# EAGLE design NN22_IMU_Adapter01_s00 (EAGLE 7.7.0)

## Sheet 1 of 2
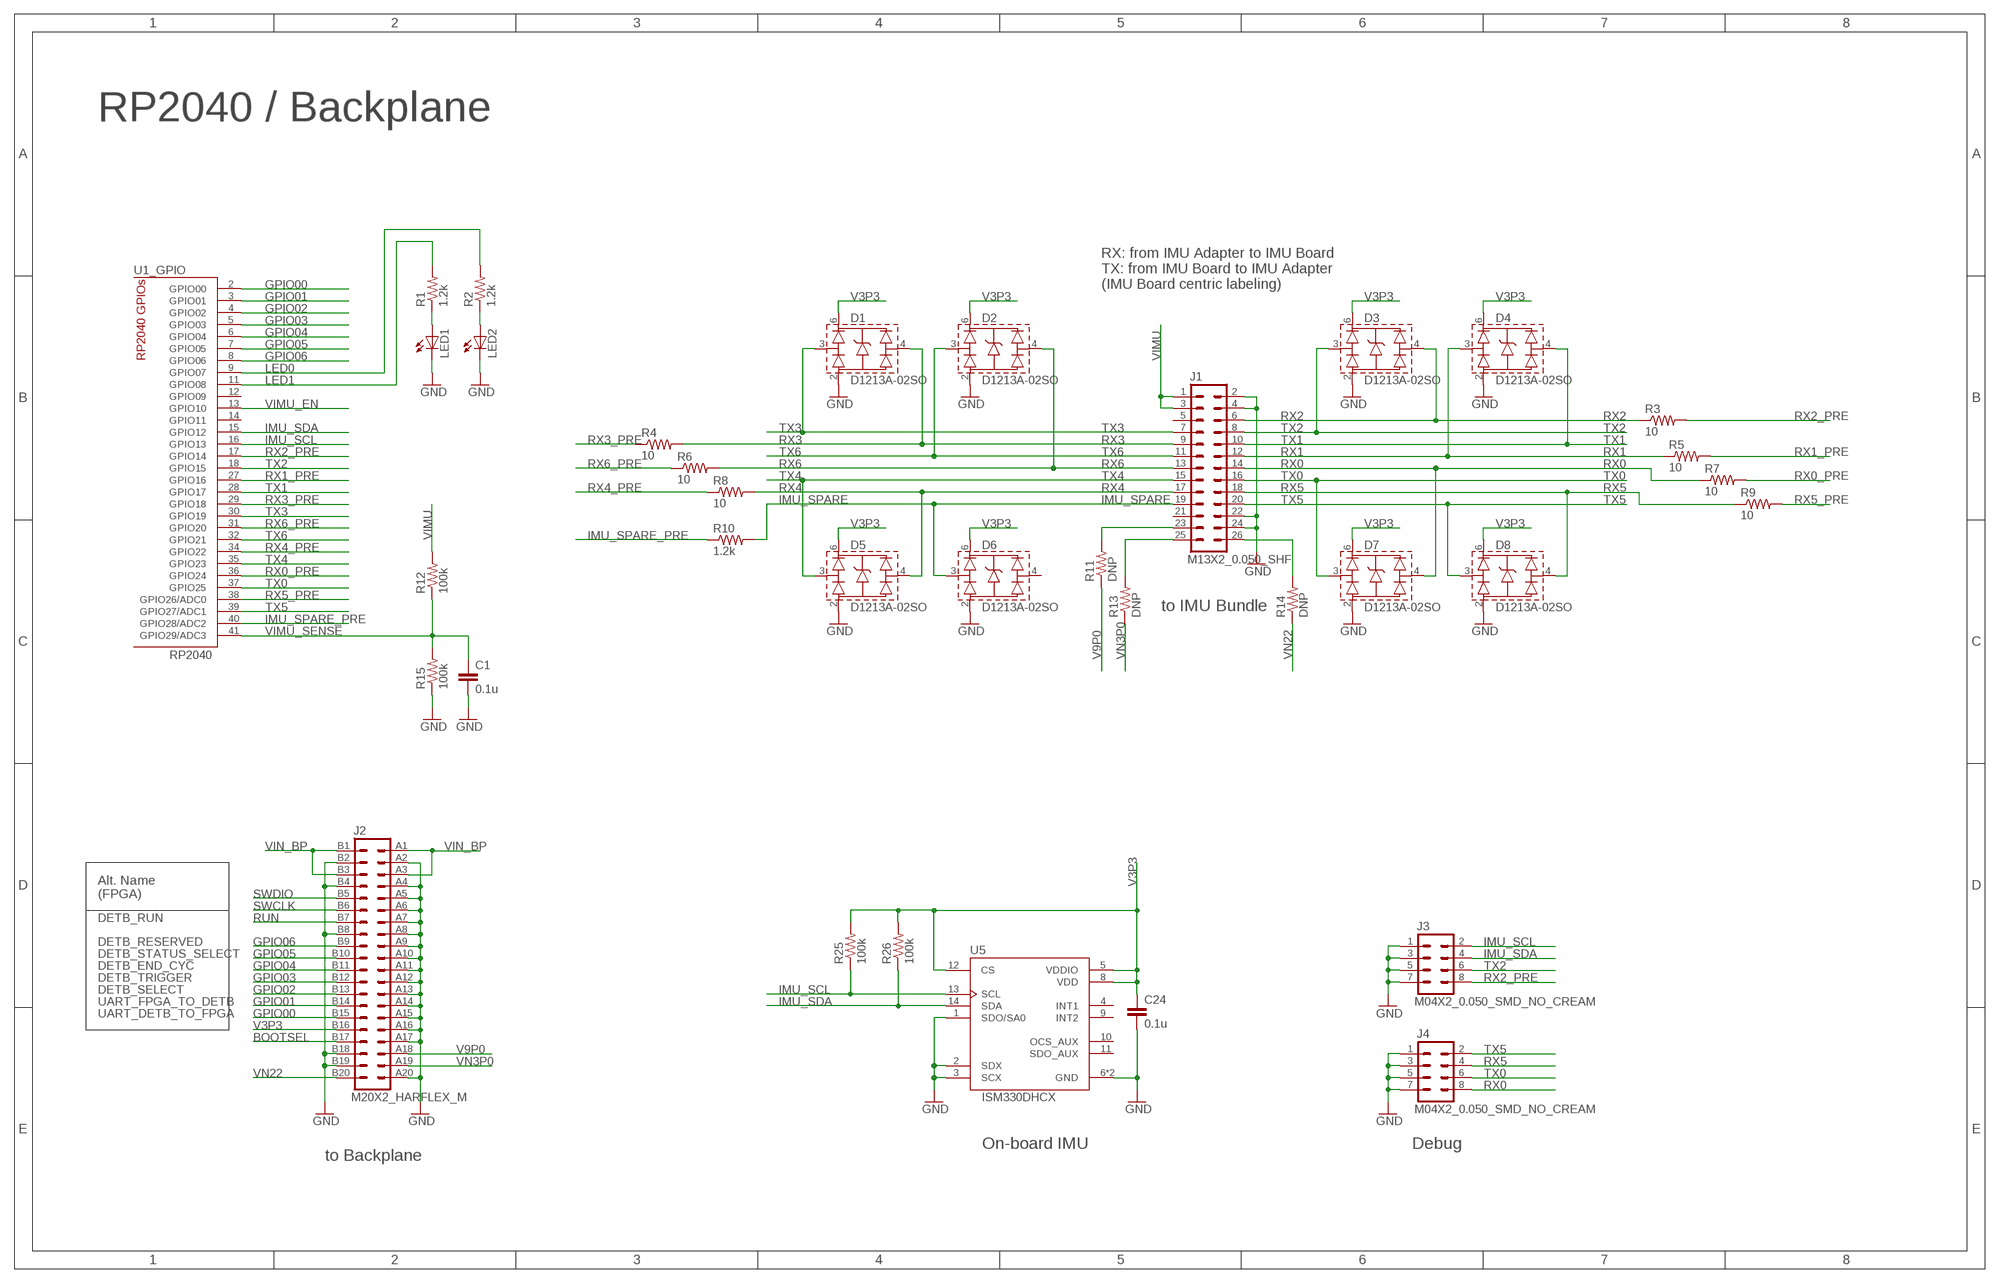
[diagram p0: schematic, sheet 1]

### Parts
C1  0.1u  CAP0402-CAP  [0402-CAP]
C24  0.1u  CAP0402-CAP  [0402-CAP]
D1  D1213A-02SO  [SOT23-6]
D2  D1213A-02SO  [SOT23-6]
D3  D1213A-02SO  [SOT23-6]
D4  D1213A-02SO  [SOT23-6]
D5  D1213A-02SO  [SOT23-6]
D6  D1213A-02SO  [SOT23-6]
D7  D1213A-02SO  [SOT23-6]
D8  D1213A-02SO  [SOT23-6]
J1  M13X2_0.050_SHF  [M13X2_0.050_SHF]
J2  M20X2_HARFLEX_M  [M20X2_HARFLEX_M]
J3  M04X2_0.050_SMD_NO_CREAM  [M04X2_0.050_SMD_NO_CREAM]
J4  M04X2_0.050_SMD_NO_CREAM  [M04X2_0.050_SMD_NO_CREAM]
LED1  LED0603  [LED-0603]
LED2  LED0603  [LED-0603]
R1  1.2k  RESISTOR0402-RES  [0402-RES]
R2  1.2k  RESISTOR0402-RES  [0402-RES]
R3  10  RESISTOR0402-RES  [0402-RES]
R4  10  RESISTOR0402-RES  [0402-RES]
R5  10  RESISTOR0402-RES  [0402-RES]
R6  10  RESISTOR0402-RES  [0402-RES]
R7  10  RESISTOR0402-RES  [0402-RES]
R8  10  RESISTOR0402-RES  [0402-RES]
R9  10  RESISTOR0402-RES  [0402-RES]
R10  1.2k  RESISTOR0402-RES  [0402-RES]
R11  DNP  RESISTOR0603-RES  [0603-RES]
R12  100k  RESISTOR0402-RES  [0402-RES]
R13  DNP  RESISTOR0603-RES  [0603-RES]
R14  DNP  RESISTOR0603-RES  [0603-RES]
R15  100k  RESISTOR0402-RES  [0402-RES]
R25  100k  RESISTOR0402-RES  [0402-RES]
R26  100k  RESISTOR0402-RES  [0402-RES]
U1  RP2040  [QFN-56_EP]
U5  ISM330DHCX  [LGA14-L]

### Nets
BOOTSEL: J2.B17 ; also sheet 2
GND: C1.2 C24.2 D1.2(VN) D2.2(VN) D3.2(VN) D4.2(VN) D5.2(VN) D6.2(VN) D7.2(VN) D8.2(VN) J1.2 J1.4 J1.22 J1.24 J2.A2 J2.A4 J2.A5 J2.A6 J2.A7 J2.A8 J2.A9 J2.A10 J2.A11 J2.A12 J2.A13 J2.A14 J2.A15 J2.A16 J2.A17 J2.A20 J2.B2 J2.B4 J2.B8 J2.B18 J2.B19 J3.1 J3.3 J3.5 J3.7 J4.1 J4.3 J4.5 J4.7 LED1.C LED2.C R15.1 U5.1(SDO/SA0) U5.2(SDX) U5.3(SCX) U5.6(GND) U5.7(GND) ; also sheet 2
GPIO00: J2.B15 U1.2(_GPIO:GPIO00)
GPIO01: J2.B14 U1.3(_GPIO:GPIO01)
GPIO02: J2.B13 U1.4(_GPIO:GPIO02)
GPIO03: J2.B12 U1.5(_GPIO:GPIO03)
GPIO04: J2.B11 U1.6(_GPIO:GPIO04)
GPIO05: J2.B10 U1.7(_GPIO:GPIO05)
GPIO06: J2.B9 U1.8(_GPIO:GPIO06)
IMU_SCL: J3.2 R25.1 U1.16(_GPIO:GPIO13) U5.13(SCL)
IMU_SDA: J3.4 R26.1 U1.15(_GPIO:GPIO12) U5.14(SDA)
IMU_SPARE: D6.3(CH1) J1.19 R10.2
IMU_SPARE_PRE: R10.1 U1.40(_GPIO:GPIO28/ADC2)
LED0: R2.2 U1.9(_GPIO:GPIO07)
LED1: R1.2 U1.11(_GPIO:GPIO08)
N$6: J1.23 R11.2
N$7: J1.25 R13.2
N$8: J1.26 R14.2
N$46: LED1.A R1.1
N$109: LED2.A R2.1
RUN: J2.B7 ; also sheet 2
RX0: D7.4(CH2) J1.14 J4.8 R7.1
RX0_PRE: R7.2 U1.36(_GPIO:GPIO24)
RX1: D4.3(CH1) J1.12 R5.1
RX1_PRE: R5.2 U1.27(_GPIO:GPIO16)
RX2: D3.4(CH2) J1.6 R3.1
RX2_PRE: J3.8 R3.2 U1.17(_GPIO:GPIO14)
RX3: D1.4(CH2) J1.9 R4.2
RX3_PRE: R4.1 U1.29(_GPIO:GPIO18)
RX4: D5.4(CH2) J1.17 R8.2
RX4_PRE: R8.1 U1.34(_GPIO:GPIO22)
RX5: D8.4(CH2) J1.18 J4.4 R9.1
RX5_PRE: R9.2 U1.38(_GPIO:GPIO26/ADC0)
RX6: D2.4(CH2) J1.13 R6.2
RX6_PRE: R6.1 U1.31(_GPIO:GPIO20)
SWCLK: J2.B6 ; also sheet 2
SWDIO: J2.B5 ; also sheet 2
TX0: D7.3(CH1) J1.16 J4.6 U1.37(_GPIO:GPIO25)
TX1: D4.4(CH2) J1.10 U1.28(_GPIO:GPIO17)
TX2: D3.3(CH1) J1.8 J3.6 U1.18(_GPIO:GPIO15)
TX3: D1.3(CH1) J1.7 U1.30(_GPIO:GPIO19)
TX4: D5.3(CH1) J1.15 U1.35(_GPIO:GPIO23)
TX5: D8.3(CH1) J1.20 J4.2 U1.39(_GPIO:GPIO27/ADC1)
TX6: D2.3(CH1) J1.11 U1.32(_GPIO:GPIO21)
V3P3: C24.1 D1.6(VP) D2.6(VP) D3.6(VP) D4.6(VP) D5.6(VP) D6.6(VP) D7.6(VP) D8.6(VP) J2.B16 R25.2 R26.2 U5.5(VDDIO) U5.8(VDD) U5.12(CS) ; also sheet 2
V9P0: J2.A18 R11.1
VIMU: J1.1 J1.3 R12.2 ; also sheet 2
VIMU_EN: U1.13(_GPIO:GPIO10) ; also sheet 2
VIMU_SENSE: C1.1 R12.1 R15.2 U1.41(_GPIO:GPIO29/ADC3)
VIN_BP: J2.A1 J2.A3 J2.B1 J2.B3 ; also sheet 2
VN3P0: J2.A19 R13.1
VN22: J2.B20 R14.1
Unconnected: D6.4(CH2) J1.5 J1.21 U1.12(_GPIO:GPIO09) U1.14(_GPIO:GPIO11) U5.4(INT1) U5.9(INT2) U5.10(OCS_AUX) U5.11(SDO_AUX)

### Notes on the sheet
- RP2040 / Backplane
- RX: from IMU Adapter to IMU Board
  TX: from IMU Board to IMU Adapter
  (IMU Board centric labeling)
- to IMU Bundle
- Alt. Name
  (FPGA)
- DETB_RUN
- DETB_RESERVED
- DETB_STATUS_SELECT
- DETB_END_CYC
- DETB_TRIGGER
- DETB_SELECT
- UART_FPGA_TO_DETB
- UART_DETB_TO_FPGA
- On-board IMU | Debug
- to Backplane

## Sheet 2 of 2
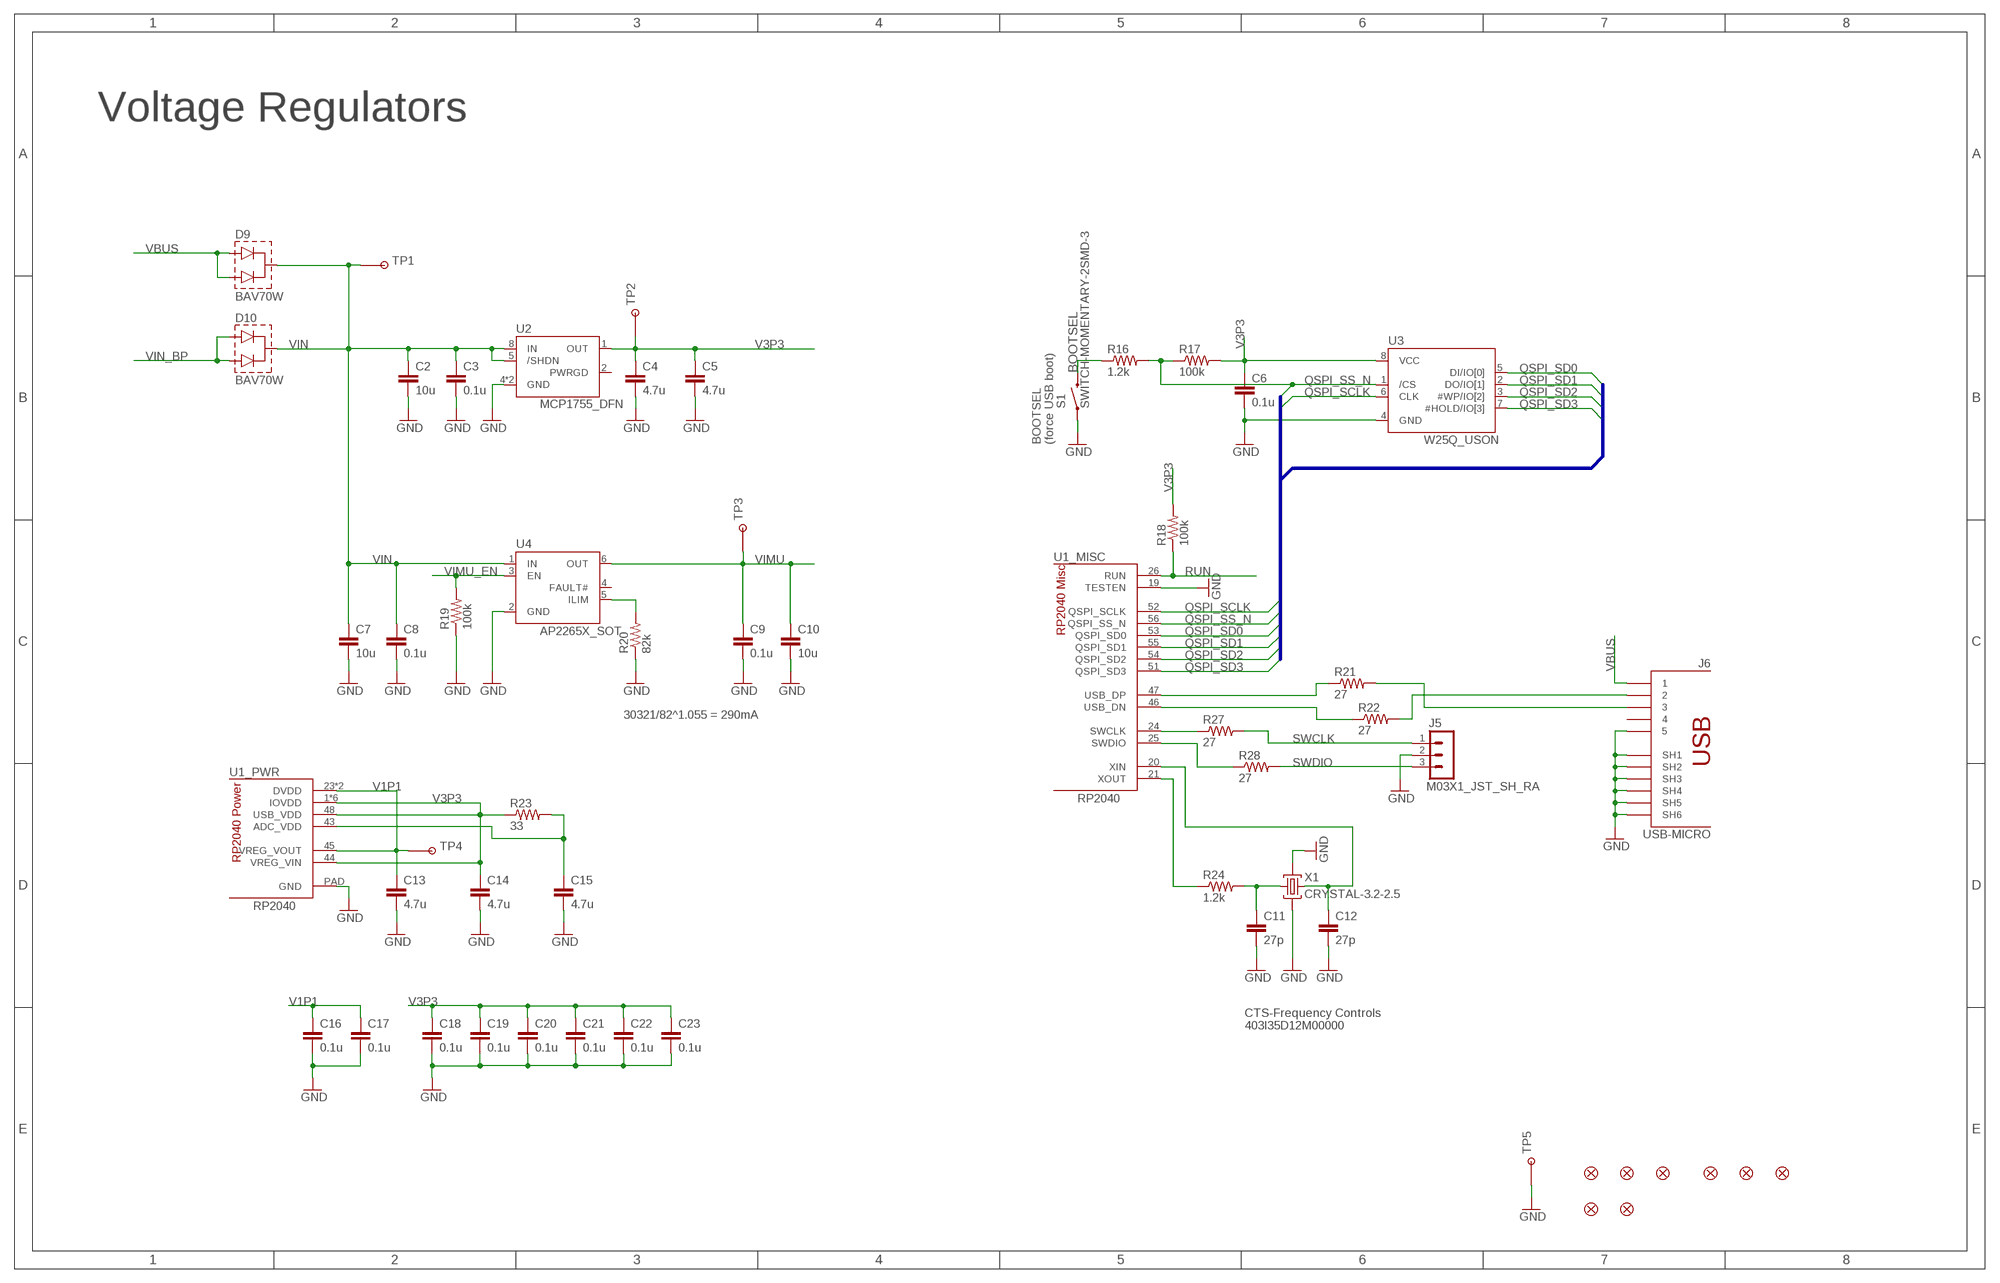
[diagram p1: schematic, sheet 2]

### Parts
C2  10u  CAP0603-CAP  [0603-CAP]
C3  0.1u  CAP0402-CAP  [0402-CAP]
C4  4.7u  CAP0402-CAP  [0402-CAP]
C5  4.7u  CAP0402-CAP  [0402-CAP]
C6  0.1u  CAP0402-CAP  [0402-CAP]
C7  10u  CAP0603-CAP  [0603-CAP]
C8  0.1u  CAP0402-CAP  [0402-CAP]
C9  0.1u  CAP0402-CAP  [0402-CAP]
C10  10u  CAP0603-CAP  [0603-CAP]
C11  27p  CAP0402-CAP  [0402-CAP]
C12  27p  CAP0402-CAP  [0402-CAP]
C13  4.7u  CAP0402-CAP  [0402-CAP]
C14  4.7u  CAP0402-CAP  [0402-CAP]
C15  4.7u  CAP0402-CAP  [0402-CAP]
C16  0.1u  CAP0402-CAP  [0402-CAP]
C17  0.1u  CAP0402-CAP  [0402-CAP]
C18  0.1u  CAP0402-CAP  [0402-CAP]
C19  0.1u  CAP0402-CAP  [0402-CAP]
C20  0.1u  CAP0402-CAP  [0402-CAP]
C21  0.1u  CAP0402-CAP  [0402-CAP]
C22  0.1u  CAP0402-CAP  [0402-CAP]
C23  0.1u  CAP0402-CAP  [0402-CAP]
D9  BAV70W  DIODE-COMMON_CATHODE_SOT323  [SOT323]
D10  BAV70W  DIODE-COMMON_CATHODE_SOT323  [SOT323]
FID1  FIDUCIALUFIDUCIAL  [MICRO-FIDUCIAL]
FID2  FIDUCIALUFIDUCIAL  [MICRO-FIDUCIAL]
FID3  FIDUCIALUFIDUCIAL  [MICRO-FIDUCIAL]
FID4  FIDUCIALUFIDUCIAL  [MICRO-FIDUCIAL]
FID5  FIDUCIALUFIDUCIAL  [MICRO-FIDUCIAL]
FID6  FIDUCIALUFIDUCIAL  [MICRO-FIDUCIAL]
FID7  FIDUCIALUFIDUCIAL  [MICRO-FIDUCIAL]
FID8  FIDUCIALUFIDUCIAL  [MICRO-FIDUCIAL]
J5  M03X1_JST_SH_RA  [M03X1_JST_SH_SM_RA]
J6  USB-MICRO  [USB-MICRO]
R16  1.2k  RESISTOR0402-RES  [0402-RES]
R17  100k  RESISTOR0402-RES  [0402-RES]
R18  100k  RESISTOR0402-RES  [0402-RES]
R19  100k  RESISTOR0402-RES  [0402-RES]
R20  82k  RESISTOR0402-RES  [0402-RES]
R21  27  RESISTOR0402-RES  [0402-RES]
R22  27  RESISTOR0402-RES  [0402-RES]
R23  33  RESISTOR0402-RES  [0402-RES]
R24  1.2k  RESISTOR0402-RES  [0402-RES]
R27  27  RESISTOR0402-RES  [0402-RES]
R28  27  RESISTOR0402-RES  [0402-RES]
S1  SWITCH-MOMENTARY-2SMD-3  [TACTILE_SWITCH_SMD-3]
TP1  TESTPOINT_ROUND  [TESTPAD_ROUND]
TP2  TESTPOINT_ROUND  [TESTPAD_ROUND]
TP3  TESTPOINT_ROUND  [TESTPAD_ROUND]
TP4  TESTPOINTPADSMALL  [TESTPAD_SMALL]
TP5  TESTPOINT1X01  [1X01]
U2  MCP1755_DFN  [DFN8_2X3MM]
U3  W25Q_USON  [USON8L-2X3MM]
U4  AP2265X_SOT  [SOT23-6]
X1  CRYSTAL-3.2-2.5  [CRYSTAL-3.2-2.5]

### Nets
BOOTSEL: R16.1 S1.4 ; also sheet 1
GND: C2.2 C3.2 C4.2 C5.2 C6.2 C7.2 C8.2 C9.2 C10.2 C11.2 C12.2 C13.2 C14.2 C15.2 C16.2 C17.2 C18.2 C19.2 C20.2 C21.2 C22.2 C23.2 J5.2 J6.5 J6.SH1 J6.SH2 J6.SH3 J6.SH4 J6.SH5 J6.SH6 R19.1 R20.1 S1.1 TP5.1 U1.19(_MISC:TESTEN) U1.PAD(_PWR:GND) U2.4(GND) U2.P(GND) U3.4(GND) U4.2(GND) X1.2(GND) X1.4(GND) ; also sheet 1
N$1: R20.2 U4.5(ILIM)
N$16: C12.1 U1.20(_MISC:XIN) X1.3(C2)
N$17: C11.1 R24.2 X1.1(C1)
N$18: R24.1 U1.21(_MISC:XOUT)
N$29: R21.1 U1.47(_MISC:USB_DP)
N$30: R22.1 U1.46(_MISC:USB_DN)
N$35: J6.2 R22.2
N$37: J6.3 R21.2
N$43: C15.1 R23.2 U1.43(_PWR:ADC_VDD)
QSPI_SCLK: U1.52(_MISC:QSPI_SCLK) U3.6(CLK)
QSPI_SD0: U1.53(_MISC:QSPI_SD0) U3.5(DI/IO[0])
QSPI_SD1: U1.55(_MISC:QSPI_SD1) U3.2(DO/IO[1])
QSPI_SD2: U1.54(_MISC:QSPI_SD2) U3.3(#WP/IO[2])
QSPI_SD3: U1.51(_MISC:QSPI_SD3) U3.7(#HOLD/IO[3])
QSPI_SS_N: R16.2 R17.1 U1.56(_MISC:QSPI_SS_N) U3.1(/CS)
RUN: R18.1 U1.26(_MISC:RUN) ; also sheet 1
SWCLK: J5.1 R27.2 ; also sheet 1
SWCLK_PRE: R27.1 U1.24(_MISC:SWCLK)
SWDIO: J5.3 R28.2 ; also sheet 1
SWDIO_PRE: R28.1 U1.25(_MISC:SWDIO)
V1P1: C13.1 C16.1 C17.1 TP4.P$1 U1.23(_PWR:DVDD) U1.45(_PWR:VREG_VOUT) U1.50(_PWR:DVDD)
V3P3: C4.1 C5.1 C6.1 C14.1 C18.1 C19.1 C20.1 C21.1 C22.1 C23.1 R17.2 R18.2 R23.1 TP2.P$1 U1.1(_PWR:IOVDD) U1.10(_PWR:IOVDD) U1.22(_PWR:IOVDD) U1.33(_PWR:IOVDD) U1.42(_PWR:IOVDD) U1.44(_PWR:VREG_VIN) U1.48(_PWR:USB_VDD) U1.49(_PWR:IOVDD) U2.1(OUT) U3.8(VCC) ; also sheet 1
VBUS: D9.1(A1) D9.2(A2) J6.1
VIMU: C9.1 C10.1 TP3.P$1 U4.6(OUT) ; also sheet 1
VIMU_EN: R19.2 U4.3(EN) ; also sheet 1
VIN: C2.1 C3.1 C7.1 C8.1 D9.3(C) D10.3(C) TP1.P$1 U2.5(/SHDN) U2.8(IN) U4.1(IN)
VIN_BP: D10.1(A1) D10.2(A2) ; also sheet 1
Unconnected: J6.4 U2.2(PWRGD) U4.4(FAULT#)

### Buses
QSPI_SCLK,QSPI_SS_N,QSPI_SD[0..3]

### Notes on the sheet
- Voltage Regulators
- BOOTSEL
  (force USB boot)
- 30321/82^1.055 = 290mA
- CTS-Frequency Controls
  403I35D12M00000

## Library data of the parts
C1-C24 = MyLib:CAP: Capacitor Standard 0603 ceramic capacitor, and 0.1" leaded capacitor.
D1-D8 = MyLib:D1213A-02SO: TVS 2 channel, steering diodes, 3.3V typ
D9 D10 = MyLib:DIODE-COMMON_CATHODE: Dual Diode Common Cathode
FID1-FID8 = MyLib:FIDUCIAL: Fiducial Alignment Points Various fiducial points for machine vision alignment.
J1 = MyLib:M13X2: Header 26 Positions SHF-113-01-L-D-SM SAM10712-ND
J2 = MyLib:M20X2
J3 J4 = MyLib:M04X2
J5 = MyLib:M03X1
J6 = MyLib:USB-MICRO: USB - micro B USB 2.0 Receptacle Connector solder retention 609-4618-2-ND
LED1 LED2 = MyLib:LED: LEDs Standard schematic elements and footprints for 5mm, 3mm, 1206, and 0603 sized LEDs. 5mm - Spark Fun Electronics SKU : COM-00529 (and others)
R1-R28 = MyLib:RESISTOR: Resistor Basic schematic elements and footprints for 0603, 1206, and PTH resistors.
S1 = MyLib:SWITCH-MOMENTARY-2: Various NO switches- pushbuttons, reed, etc
TP1-TP5 = MyLib:TESTPOINT
U1 = MyLib:RP2040: RP2040 Raspberry Pi Pico Microcontroller
U2 = MyLib:MCP1755: LDO 16V 300 mA e.g. MCP1755-3302E/MC-ND
U3 = MyLib:W25Q: Flash, Serial e.g. W25Q16JVUXIQ
U4 = MyLib:AP2265X: Power Switch, precision-adjustable, current-limited 2.1A / 5.5V
U5 = MyLib:ISM330DHCX: IMU 6 axis; MF: STMicroelectronics; MP: ISM330DHCX
X1 = MyLib:CRYSTAL-3.2-2.5: SMD Quartz Crystal e.g. CTS Series 403

## Board
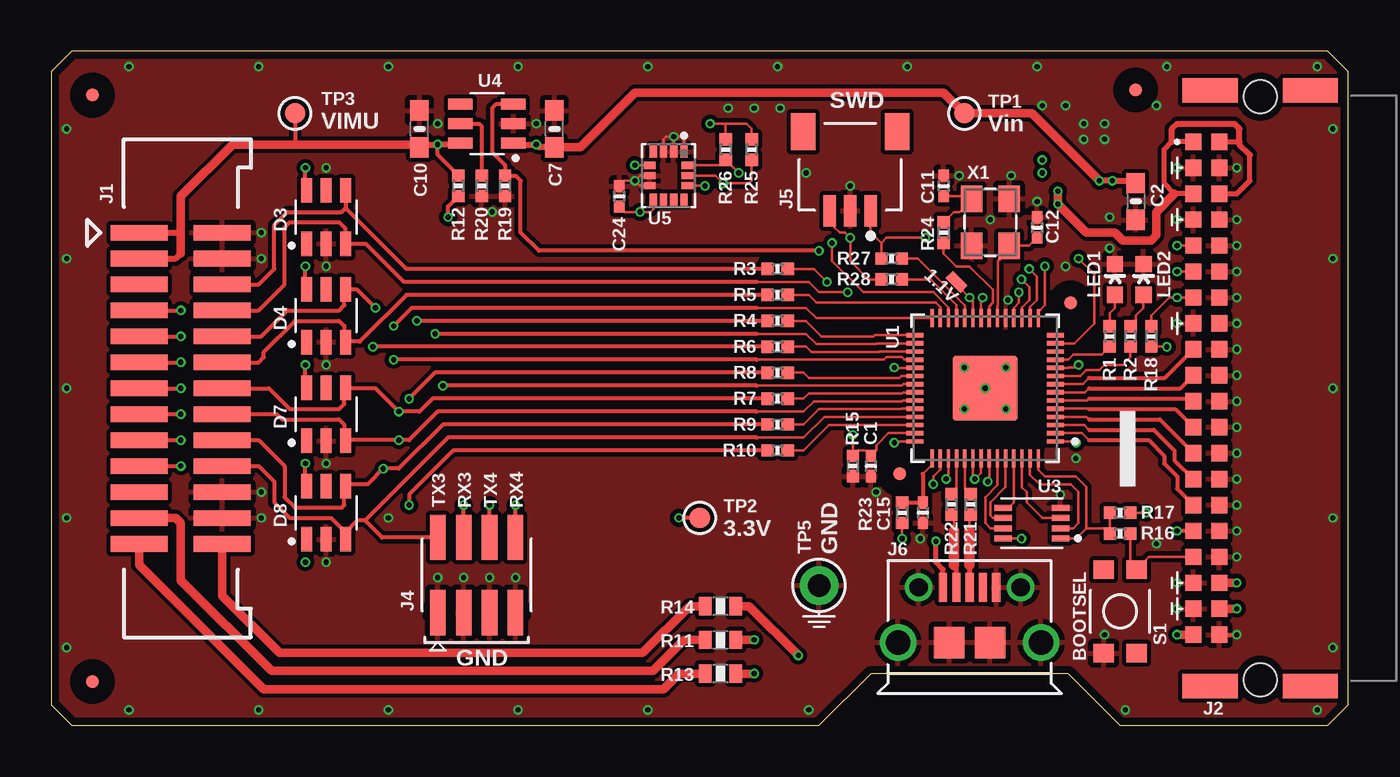
[diagram p2: board, top side]
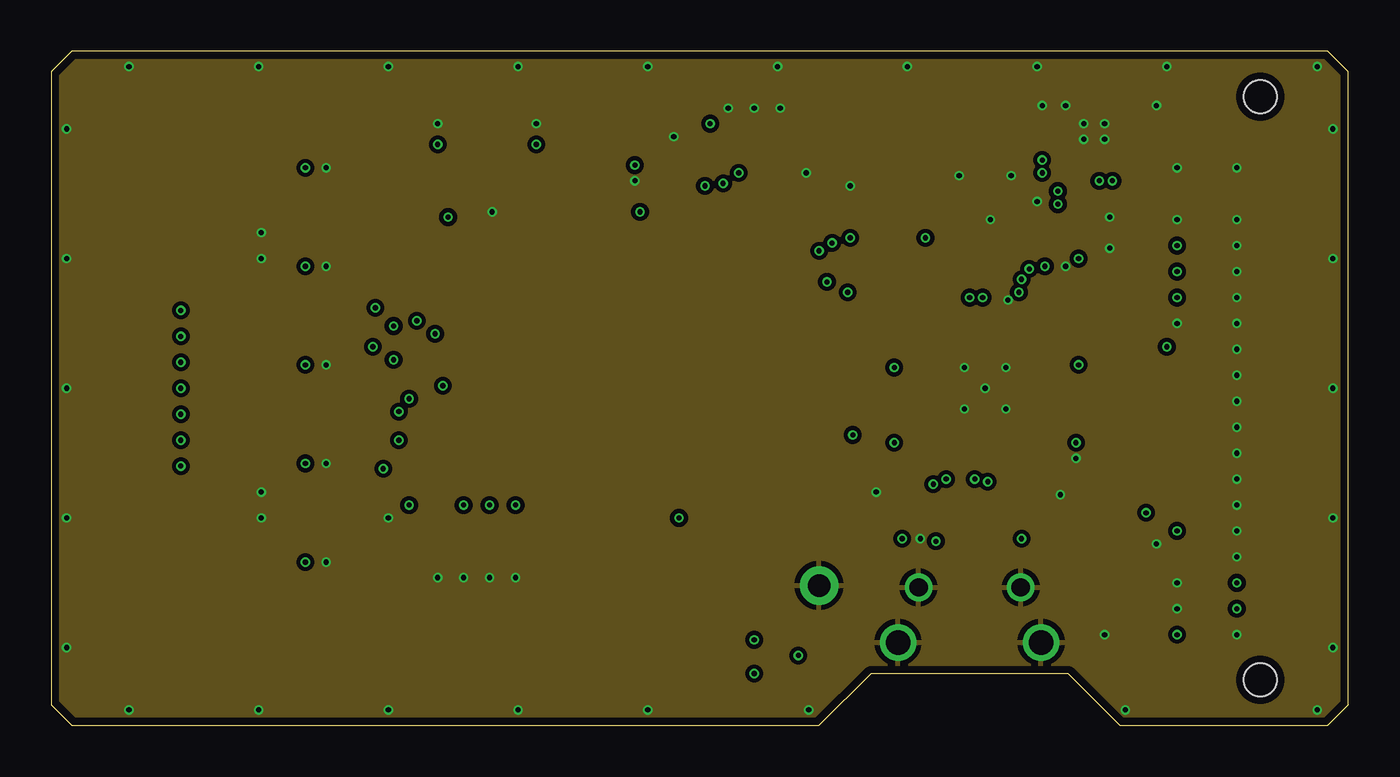
[diagram p3: board, inner layer Route2]
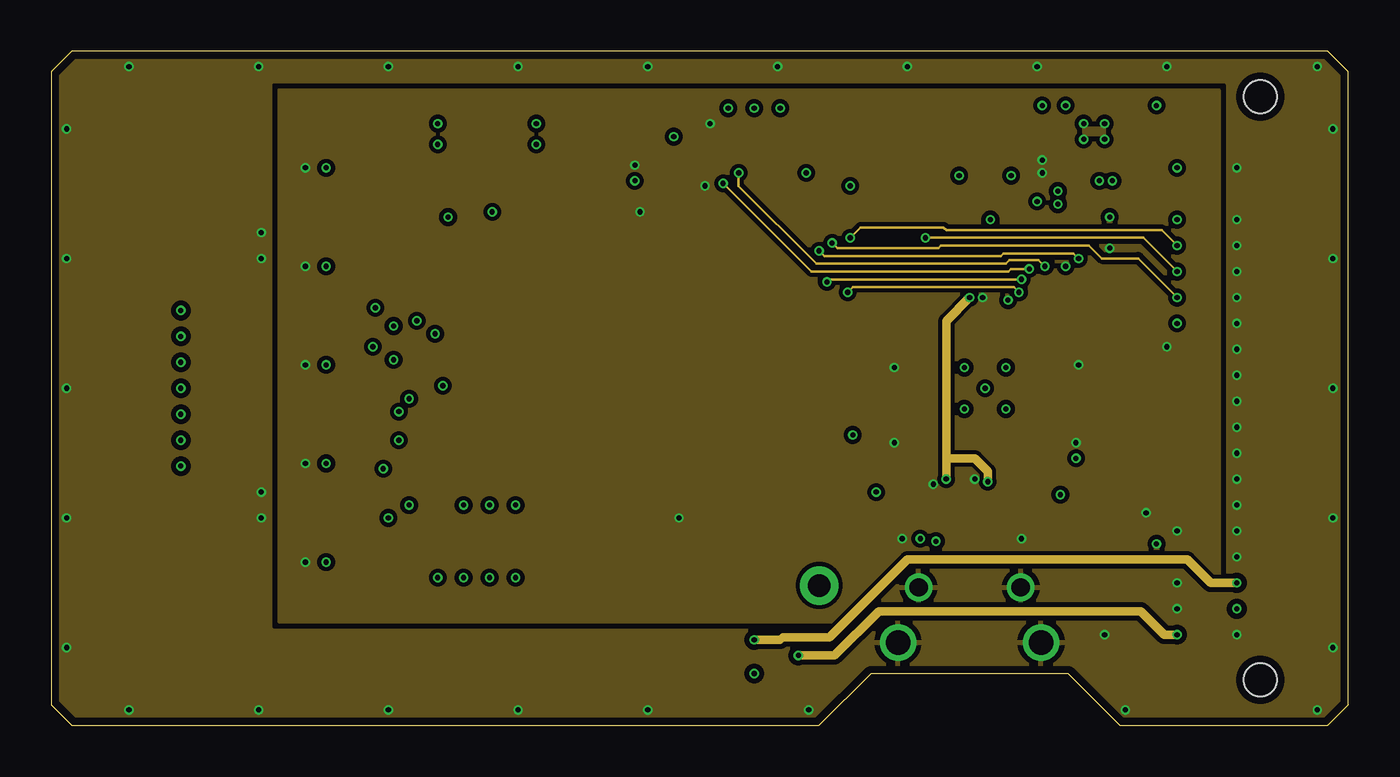
[diagram p4: board, inner layer Route15]
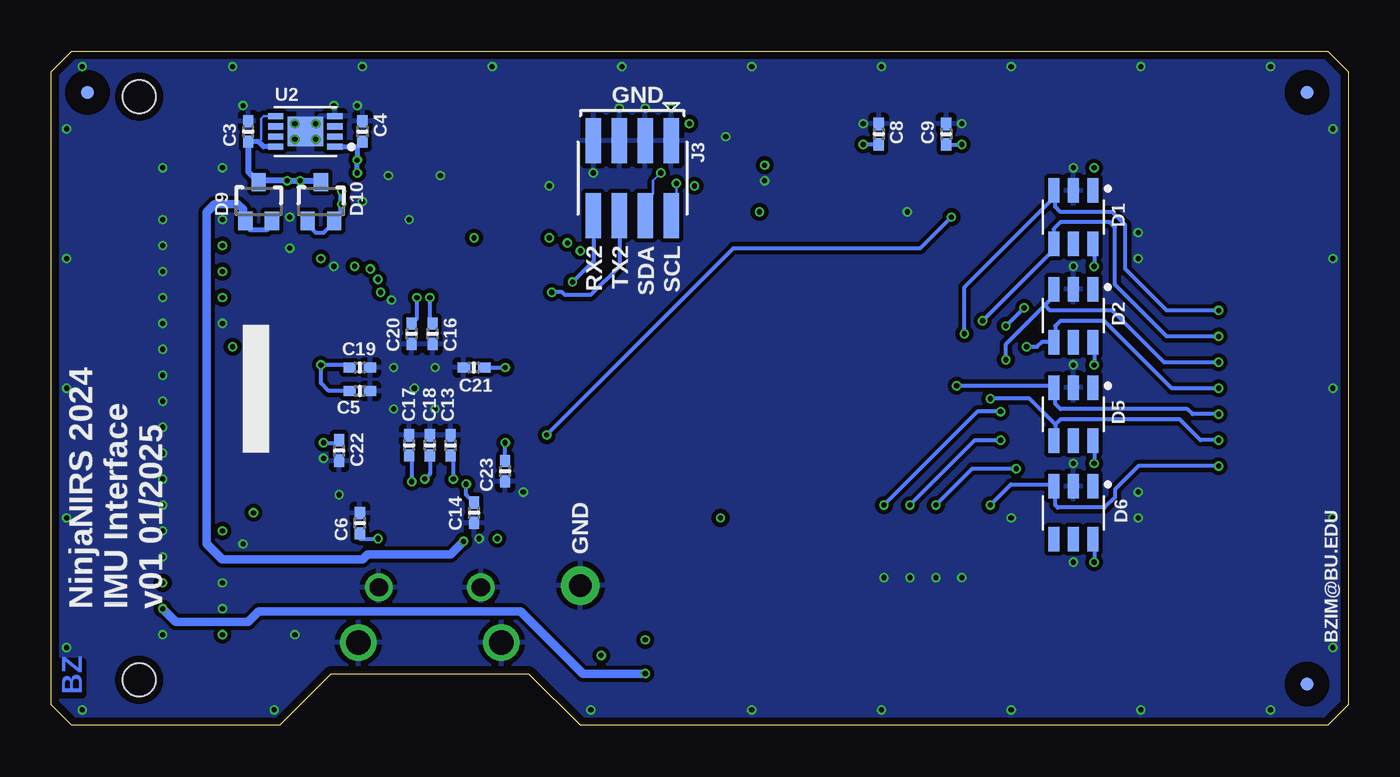
[diagram p5: board, bottom side, seen from below]

Size 63.5 x 33.02 mm. Coordinates in mm from the lower left corner, seen from the top.
Outline: 63.5,1.02 63.5,32 62.48,33.02 1.02,33.02 0,32 0,1.02 1.02,0 37.59,0 40.13,2.54 49.78,2.54 52.32,0 62.48,0 63.5,1.02
Copper layers (1*2*15*16): Top 0.035559375mm / dielectric 0.17018125mm / Route2 0.01778125mm / dielectric 47mil / Route15 0.01778125mm / dielectric 0.17018125mm / Bottom 0.035559375mm
Design rules "OSHPark-4layer *": minimum track width 5mil, minimum drill 10mil, track to track 5mil, track to pad 5mil, pad to pad 5mil, via to via 5mil, smd to smd 5mil, copper to edge 15mil, drill to drill 6mil, minimum pad ring 4mil, minimum via ring 4mil, stop-mask expansion 2mil, vias tented up to drill 12mil, thermal gap 10mil
tRestrict: area 57,24.1 to 57.3,24.2; area 57,22.8 to 57.3,22.9; area 57,21.6 to 57.3,21.6; area 57,20.3 to 57.3,20.3; area 57,19 to 57.3,19.1; area 57,17.8 to 57.3,17.8; area 57,16.5 to 57.3,16.5; area 57,15.2 to 57.3,15.3; area 57,13.9 to 57.3,14; area 57,12.7 to 57.3,12.7; area 57,11.4 to 57.3,11.5; area 57,10.1 to 57.3,10.2; 6 more areas; 5 lines

### Footprints (pad centres in the part's own frame; a part is rotated, then mirrored left to right if it is on the bottom)
0402-CAP = smd 0.6 x 0.5: 1 -0.5,0; 2 0.5,0
0603-CAP = smd 1 x 0.9: 1 -0.9,0; 2 0.9,0
SOT23-6 = smd 1.2 x 0.55: 1 -1.3,0.95; 2 -1.3,0; 3 -1.3,-0.95; 4 1.3,-0.95; 5 1.3,0; 6 1.3,0.95
SOT323 = smd 0.9 x 0.7: 1 -0.95,0.65; 2 -0.95,-0.65; 3 0.95,0
MICRO-FIDUCIAL = smd 0.635 x 0.635: 1 0,0
M13X2_0.050_SHF = smd 2.794 x 0.762: 1 -2.032,7.62; 2 2.032,7.62; 3 -2.032,6.35; 4 2.032,6.35; 5 -2.032,5.08; 6 2.032,5.08; 7 -2.032,3.81; 8 2.032,3.81; 9 -2.032,2.54; 10 2.032,2.54; 11 -2.032,1.27; 12 2.032,1.27; 13 -2.032,0; 14 2.032,0; 15 -2.032,-1.27; 16 2.032,-1.27; 17 -2.032,-2.54; 18 2.032,-2.54; 19 -2.032,-3.81; 20 2.032,-3.81; 21 -2.032,-5.08; 22 2.032,-5.08; 23 -2.032,-6.35; 24 2.032,-6.35; 25 -2.032,-7.62; 26 2.032,-7.62
M20X2_HARFLEX_M = smd 0.8 x 0.8: A1 12.065,2; A2 10.795,2; A3 9.525,2; A4 8.255,2; A5 6.985,2; A6 5.715,2; A7 4.445,2; A8 3.175,2; A9 1.905,2; A10 0.635,2; A11 -0.635,2; A12 -1.905,2; A13 -3.175,2; A14 -4.445,2; A15 -5.715,2; A16 -6.985,2; A17 -8.255,2; A18 -9.525,2; A19 -10.795,2; A20 -12.065,2; B1 12.065,3.27; B2 10.795,3.27; B3 9.525,3.27; B4 8.255,3.27; B5 6.985,3.27; B6 5.715,3.27; B7 4.445,3.27; B8 3.175,3.27; B9 1.905,3.27; B10 0.635,3.27; B11 -0.635,3.27; B12 -1.905,3.27; B13 -3.175,3.27; B14 -4.445,3.27; B15 -5.715,3.27; B16 -6.985,3.27; B17 -8.255,3.27; B18 -9.525,3.27; B19 -10.795,3.27; B20 -12.065,3.27 | smd 1.2 x 2.7: P$17 -14.575,2.45; P$18 -14.575,-2.45; P$19 14.575,2.45; P$20 14.575,-2.45 | hole 1.6: -14.275,0; 14.275,0
M04X2_0.050_SMD_NO_CREAM = smd 2.21 x 0.762: 1 -1.841,1.905; 2 1.841,1.905; 3 -1.841,0.635; 4 1.841,0.635; 5 -1.841,-0.635; 6 1.841,-0.635; 7 -1.841,-1.905; 8 1.841,-1.905
M03X1_JST_SH_SM_RA = smd 0.6 x 1.55: 1 -1,4.775; 2 0,4.775; 3 1,4.775 | smd 1.2 x 1.8: PAD1 -2.3,0.9; PAD2 2.3,0.9
USB-MICRO = smd 0.4 x 1.4: 1 -1.3,2.7; 2 -0.65,2.7; 3 0,2.7; 4 0.65,2.7; 5 1.3,2.7 | drill 0.9: SH1 -2.5,2.7; SH2 2.5,2.7 | drill 1.2: SH3 -3.5,0; SH6 3.5,0 | smd 1.5 x 1.55: SH4 -1,0; SH5 1,0
LED-0603 = smd 0.8 x 0.8: A 0,-0.75; C 0,0.75
0402-RES = smd 0.6 x 0.6: 1 -0.5,0; 2 0.5,0
0603-RES = smd 0.6 x 0.9: 1 -0.75,0; 2 0.75,0
TACTILE_SWITCH_SMD-3 = smd 0.9 x 1: 1 -2.05,0.8; 2 2.05,0.8; 3 -2.05,-0.8; 4 2.05,-0.8
TESTPAD_ROUND = smd 1.016 x 1.016: P$1 0,0
TESTPAD_SMALL = smd 1.016 x 0.508: P$1 0,0
1X01 = drill 1.1 pad 1.88: 1 0,0
QFN-56_EP = smd 0.875 x 0.2: 1 -3.438,2.6; 2 -3.438,2.2; 3 -3.438,1.8; 4 -3.438,1.4; 5 -3.438,1; 6 -3.438,0.6; 7 -3.438,0.2; 8 -3.438,-0.2; 9 -3.438,-0.6; 10 -3.438,-1; 11 -3.438,-1.4; 12 -3.438,-1.8; 13 -3.438,-2.2; 14 -3.438,-2.6; 29 3.438,-2.6; 30 3.438,-2.2; 31 3.438,-1.8; 32 3.438,-1.4; 33 3.438,-1; 34 3.438,-0.6; 35 3.438,-0.2; 36 3.438,0.2; 37 3.438,0.6; 38 3.438,1; 39 3.438,1.4; 40 3.438,1.8; 41 3.438,2.2; 42 3.438,2.6 | smd 0.2 x 0.875: 15 -2.6,-3.438; 16 -2.2,-3.438; 17 -1.8,-3.438; 18 -1.4,-3.438; 19 -1,-3.438; 20 -0.6,-3.438; 21 -0.2,-3.438; 22 0.2,-3.438; 23 0.6,-3.438; 24 1,-3.438; 25 1.4,-3.438; 26 1.8,-3.438; 27 2.2,-3.438; 28 2.6,-3.438; 43 2.6,3.438; 44 2.2,3.438; 45 1.8,3.438; 46 1.4,3.438; 47 1,3.438; 48 0.6,3.438; 49 0.2,3.438; 50 -0.2,3.438; 51 -0.6,3.438; 52 -1,3.438; 53 -1.4,3.438; 54 -1.8,3.438; 55 -2.2,3.438; 56 -2.6,3.438 | smd 3.2 x 3.2: PAD 0,0
DFN8_2X3MM = smd 0.75 x 0.3: 1 -1.45,0.75; 2 -1.45,0.25; 3 -1.45,-0.25; 4 -1.45,-0.75; 5 1.45,-0.75; 6 1.45,-0.25; 7 1.45,0.25; 8 1.45,0.75 | smd 1.75 x 1.45: P 0,0
USON8L-2X3MM = smd 0.85 x 0.3: 1 -1.4,0.75; 2 -1.4,0.25; 3 -1.4,-0.25; 4 -1.4,-0.75; 5 1.4,-0.75; 6 1.4,-0.25; 7 1.4,0.25; 8 1.4,0.75
LGA14-L = smd 0.58 x 0.35: 1 -1.175,0.75; 2 -1.175,0.25; 3 -1.175,-0.25; 4 -1.175,-0.75; 8 1.175,-0.75; 9 1.175,-0.25; 10 1.175,0.25; 11 1.175,0.75 | smd 0.35 x 0.58: 5 -0.5,-0.925; 6 0,-0.925; 7 0.5,-0.925; 12 0.5,0.925; 13 0,0.925; 14 -0.5,0.925
CRYSTAL-3.2-2.5 = smd 1.3 x 1.05: 1 -1.15,-0.925; 2 1.15,-0.925; 3 1.15,0.925; 4 -1.15,0.925

### Placement (x,y rotation side)
C1  40.13,12.7 270 top
C2  53.09,25.65 270 top
C3  53.85,29.08 90 bottom
C4  48.26,29.08 90 bottom
C5  48.39,16.38 0 bottom
C6  48.39,9.91 90 bottom
C7  24.64,29.21 90 top
C8  22.99,28.96 90 bottom
C9  19.68,28.96 90 bottom
C10  18.03,29.21 90 top
C11  43.69,26.42 90 top
C12  48.26,24.38 90 top
C13  43.94,13.72 90 bottom
C14  42.8,10.41 270 bottom
C15  42.67,10.41 270 top
C16  44.83,19.18 270 bottom
C17  45.97,13.72 90 bottom
C18  44.96,13.72 90 bottom
C19  48.39,17.53 0 bottom
C20  45.85,19.18 270 bottom
C21  42.8,17.53 180 bottom
C22  49.4,13.46 270 bottom
C23  41.27,12.45 270 bottom
C24  27.81,25.91 90 top
D1  13.46,24.89 270 bottom
D2  13.46,20.07 270 bottom
D3  13.46,24.89 90 top
D4  13.46,20.07 90 top
D5  13.46,15.24 270 bottom
D6  13.46,10.41 270 bottom
D7  13.46,15.24 90 top
D8  13.46,10.41 90 top
D9  53.34,25.65 90 bottom
D10  50.29,25.65 90 bottom
FID1  2.03,30.86 0 top
FID2  2.03,2.16 0 top
FID3  53.09,31.11 0 top
FID4  2.03,30.99 0 bottom
FID5  2.03,2.03 0 bottom
FID6  61.72,30.99 0 bottom
FID7  49.91,20.7 0 top
FID8  41.53,12.32 0 top
J1  6.35,16.51 0 top
J2  59.18,16.51 90 top
J3  35.05,26.8 270 bottom
J4  20.83,7.37 90 top
J5  39.12,29.97 180 top
J6  44.96,4.06 0 top
LED1  52.07,21.84 0 top
LED2  53.47,21.84 0 top
R1  51.82,19.05 270 top
R2  52.83,19.05 270 top
R3  35.56,22.35 0 top
R4  35.56,19.81 180 top
R5  35.56,21.08 0 top
R6  35.56,18.54 180 top
R7  35.56,16 0 top
R8  35.56,17.27 180 top
R9  35.56,14.73 0 top
R10  35.56,13.46 180 top
R11  32.77,4.19 180 top
R12  19.94,26.42 90 top
R13  32.77,2.54 180 top
R14  32.77,5.84 180 top
R15  39.24,12.7 90 top
R16  52.32,9.4 180 top
R17  52.32,10.41 0 top
R18  53.85,19.05 270 top
R19  22.23,26.42 90 top
R20  21.08,26.42 90 top
R21  45.01,10.82 270 top
R22  44.07,10.82 270 top
R23  41.66,10.41 90 top
R24  43.69,24.13 90 top
R25  34.29,28.19 90 top
R26  33.02,28.19 90 top
R27  41.15,22.86 180 top
R28  41.15,21.84 180 top
S1  52.32,5.59 90 top
TP1  44.7,29.97 0 top
TP2  31.75,10.16 0 top
TP3  11.94,29.97 0 top
TP4  44.32,21.72 135 top
TP5  37.59,6.86 0 top
U1  45.72,16.51 180 top
U2  51.05,29.08 180 bottom
U3  48.01,9.91 180 top
U4  21.34,29.46 180 top
U5  30.23,26.92 270 top
X1  45.97,24.64 270 top

### Tracks (layer width: path | path; a pad name or v marks a point on that pad's centre or on a via)
BOOTSEL
  Top 0.127: J2.B17 53.74,8.26 S1.4 52.82,7.94 R16.1
GND  (via drill 0.25)
  Top 0.127: v28.57,26.67 28.07,26.67 C24.2 | U5.7 28.82,26.42 v28.57,26.67 | U5.6 28.83,26.92 v28.57,26.67 | U5.3 29.98,28.57 29.97,28.57 29.97,28.7 30.1,28.83 v30.48,28.83 | U5.1 30.98,28.69 30.99,28.7 30.86,28.83 v30.48,28.83 | U5.2 v30.48,28.82 v30.48,28.83
  Top 0.203: J2.A20 v58.04,4.45
  other vias: 10.16,32.26 52.58,0.76 51.82,23.37 58.04,20.95 3.81,0.76 61.98,0.76 58.04,22.23 55.12,24.77 58.04,15.88 58.04,13.34 49.4,11.3 51.82,24.89 50.55,29.46 51.56,29.46 51.56,28.7 50.55,28.7 49.66,30.35 54.1,30.35 48.51,30.35 10.16,0.76 22.86,0.76 29.21,0.76 37.08,0.76 58.04,9.53 58.04,8.26 55.12,5.71 55.12,6.99 55.12,19.68 58.04,27.3 51.56,4.45 44.7,17.53 46.74,17.53 46.74,15.49 44.7,15.49 42.55,9.14 49.66,22.48 48.26,25.65 44.45,26.92 45.97,24.77 39.12,26.42 40.39,11.43 55.12,27.3 58.04,24.77 58.04,23.5 58.04,19.68 58.04,18.41 58.04,17.14 58.04,14.61 58.04,12.06 58.04,10.79 3.81,32.26 16.51,32.26 22.86,32.26 29.21,32.26 35.56,32.26 41.91,32.26 48.26,32.26 54.61,32.26 61.98,32.26 0.76,3.81 0.76,10.16 0.76,16.51 0.76,22.86 0.76,29.21 62.74,3.81 62.74,10.16 62.74,16.51 62.74,22.86 62.74,29.21 50.16,13.08 54.1,8.89 45.72,16.51 46.99,26.92 16.51,0.76 13.46,27.3 13.46,22.48 13.46,17.65 13.46,12.83 13.46,8 23.75,29.46 18.92,29.46 21.59,25.15 10.29,24.13 10.29,22.86 10.29,11.43 10.29,10.16 18.92,7.24 20.19,7.24 21.46,7.24 22.73,7.24 16.51,10.16 34.42,30.23 33.15,30.23 35.69,30.23 36.96,27.05 46.84,20.83
  pour Route2 (isolate 0.203, rank 6): 0,0 63.5,0 63.5,33.02 0,33.02
  pour Route15 (isolate 0.254, rank 6): 0,0 63.5,0 63.5,33.02 0,33.02
  pour Top (isolate 0.203, rank 6): 0,33.02 63.5,33.02 63.5,0 0,0
  pour Bottom (isolate 0.203, rank 6): 0,33.02 63.5,33.02 63.5,0 0,0
  pour Bottom (isolate 0.203, no thermals): 50.67,30.23 50.67,27.94 51.44,27.94 51.44,30.23
  cutout Top: 42.93,19.3 48.51,19.3 48.51,13.72 42.93,13.72
GPIO00
  Top 0.127: U1.2 50.46,14.31 50.8,13.97
  Top 0.203: 50.8,13.97 53.72,13.97 54.48,13.21 54.48,12.83 55.12,12.19 55.12,11.59 J2.B15
GPIO01
  Top 0.127: U1.3 50.57,14.71 50.8,14.48
  Top 0.203: 50.8,14.48 53.98,14.48 54.99,13.46 54.99,12.99 J2.B14
GPIO02
  Top 0.127: U1.4 50.68,15.11 50.8,14.99
  Top 0.203: 50.8,14.99 54.26,14.99 J2.B13
GPIO03
  Top 0.127: U1.5 50.78,15.51 50.8,15.49
  Top 0.203: 50.8,15.49 55.02,15.49 J2.B12
GPIO04
  Top 0.127: U1.6 50.71,15.91 50.8,16
  Top 0.203: 50.8,16 55.78,16 J2.B11
GPIO05
  Top 0.127: U1.7 50.6,16.31 50.8,16.51
  Top 0.203: 50.8,16.51 55.28,16.51 J2.B10
GPIO06
  Top 0.127: U1.8 50.49,16.71 50.8,17.02
  Top 0.203: 50.8,17.02 54.52,17.02 J2.B9
IMU_SCL  (via drill 0.25)
  Top 0.127: U5.13 32.51,26.92 v32.89,26.54 34.16,26.54 34.29,26.67 R25.1 | v47.88,22.35 48.26,21.97 48.26,20.83 47.92,20.49 U1.16
  Route15 0.127: v47.88,22.35 46.99,22.35 46.86,22.23 37.21,22.23 v32.89,26.54
  Bottom 0.127: v32.89,26.54 32.89,25.21 J3.2
IMU_SDA  (via drill 0.25)
  Top 0.127: v48.64,22.48 48.64,20.57 48.32,20.25 U1.15 | v33.66,27.05 33.4,27.3 33.4,27.31 R26.1 32.75,27.42 U5.14
  Route15 0.127: v48.64,22.48 48.34,22.78 46.91,22.78 46.74,22.61 37.47,22.61 33.66,26.42 v33.66,27.05
  Bottom 0.127: J3.4 34.42,25.65 34.04,26.04 34.04,26.67 v33.66,27.05
IMU_SPARE  (via drill 0.25)
  Top 0.203: R10.2 19.68,13.46 17.53,11.3 v17.53,10.79 | J1.19 v6.35,12.7
  Bottom 0.203: v17.53,10.79 16.51,11.81 14.51,11.81 D6.3 14.35,11.65 14.35,10.79 14.22,10.67 11.94,10.67 11.43,11.18 11.43,11.56 10.29,12.7 v6.35,12.7
IMU_SPARE_PRE
  Top 0.127: U1.40 38.08,14.71 36.83,13.46 R10.1
LED0
  Top 0.127: U1.9 50.38,17.11 50.67,17.4 51.31,17.4 51.56,17.65 52.45,17.65 52.83,18.03 R2.2
LED1
  Top 0.127: U1.11 49.79,17.91 50.04,18.16 51.44,18.16 R1.2
N$1
  Top 0.203: U4.5 20.95,29.46 21.08,29.34 R20.2
N$6
  Top 0.406: R11.2 30.99,4.19 29.46,2.67 10.79,2.67 6.35,7.11 6.35,9.91 6.1,10.16 J1.23
N$7
  Top 0.406: R13.2 30.73,2.54 29.97,1.78 10.41,1.78 4.32,7.87 J1.25
N$8
  Top 0.406: R14.2 31.24,5.84 28.96,3.56 11.18,3.56 8.38,6.35 J1.26
N$16
  Top 0.127: C12.1 47.86,23.49 X1.3 46.48,23.07 46.48,22.86 46.35,22.73 46.35,20.57 46.32,20.54 U1.20
N$17
  Top 0.127: R24.2 44.2,25.15 44.45,25.15 44.7,25.4 44.7,25.44 X1.1 | 44.93,25.91 X1.1 | C11.1 44.92,25.92 X1.1
N$18
  Top 0.127: R24.1 43.69,23.11 44.32,22.48 44.96,22.48 46.1,21.34 46.1,20.7 45.92,20.52 U1.21
N$29
  Top 0.127: U1.47 44.72,11.61 R21.1
N$30
  Top 0.127: U1.46 44.32,11.57 R22.1
N$35
  Top 0.127: 44.2,9.53 44.2,10.19 R22.2
  Top 0.254: J6.2 44.31,7.76 44.2,7.87
  Top 0.508: 44.2,9.53 44.2,7.87
N$37
  Top 0.127: 44.96,9.53 44.96,10.37 R21.2
  Top 0.254: 44.96,7.87 J6.3
  Top 0.508: 44.96,9.53 44.96,7.87
N$43
  Top 0.127: U1.43 43.12,12.77 42.67,12.32
  Top 0.203: R23.2 C15.1 42.67,12.32
N$46
  Top 0.127: R1.1 51.82,20.19 52.07,20.45 LED1.A
N$109
  Top 0.127: R2.1 53.09,19.81 53.09,20.07 53.47,20.45 LED2.A
QSPI_SCLK
  Top 0.127: U3.6 46.1,10.16 45.97,10.29 45.97,10.92 46.72,11.67 U1.52
QSPI_SD0
  Top 0.127: U3.5 46.85,10.66 47.12,10.92 47.12,11.68 47.12,11.69 U1.53
QSPI_SD1
  Top 0.127: U3.2 50.04,9.66 50.29,9.91 50.29,11.43 49.91,11.81 48.39,11.81 47.92,12.28 U1.55
QSPI_SD2
  Top 0.127: U3.3 48.52,10.16 47.75,10.92 47.75,11.43 47.52,11.66 U1.54
QSPI_SD3
  Top 0.127: U3.7 45.97,9.66 45.72,9.91 45.72,11.18 46.32,11.78 U1.51
QSPI_SS_N
  Top 0.127: U3.1 50.18,9.16 50.67,9.65 | 50.67,9.65 50.67,11.68 50.16,12.19 48.64,12.19 48.32,12.51 U1.56 | 50.67,9.65 51.57,9.65 R16.2 R17.1
RUN  (via drill 0.25)
  Top 0.127: U1.26 43.92,20.47 43.18,21.21 39.75,21.21 38.23,22.73 v38.23,23.62 | J2.B7 v55.12,20.95 54.74,20.95 53.85,20.07 R18.1
  Route15 0.127: v38.23,23.62 38.48,23.37 43.43,23.37 43.56,23.5 50.8,23.5 51.44,22.86 53.21,22.86 v55.12,20.95
RX0  (via drill 0.25)
  Top 0.203: R7.1 18.67,16 18.03,15.37 v17.02,15.37 15.88,16.51 14.44,16.51 D7.4 14.35,16.48 14.35,15.75 14.1,15.49 11.68,15.49 10.67,16.51 J1.14 | J4.8 v22.73,10.79
  Bottom 0.203: v22.73,10.79 18.16,15.37 v17.02,15.37
RX0_PRE
  Top 0.127: U1.36 41.71,16.31 41.66,16.26 37.08,16.26 36.83,16 R7.2
RX1
  Top 0.203: R5.1 17.4,21.08 15.11,18.8 14.44,18.8 D4.3 14.35,18.83 14.35,19.56 14.1,19.81 11.94,19.81 10.41,18.29 10.41,18.03 10.16,17.78 J1.12
RX1_PRE
  Top 0.127: U1.27 43.52,20.49 43.31,20.7 37.47,20.7 37.08,21.08 R5.2
RX2
  Top 0.203: R3.1 17.4,22.35 14.41,25.34 | D3.4 14.41,25.34 | J1.6 10.16,21.59 10.92,22.35 10.92,24.51 11.56,25.15 14.22,25.15 14.41,25.34
RX2_PRE  (via drill 0.25)
  Top 0.127: v37.97,21.72 37.34,22.35 R3.2 | U1.17 47.52,20.47 47.88,20.83 47.88,21.46 v47.5,21.84
  Route15 0.127: v47.5,21.84 38.1,21.84 v37.97,21.72
  Bottom 0.203: J3.8 36.96,22.73 v37.97,21.72
RX3  (via drill 0.25)
  Top 0.203: R4.2 v17.91,19.81 | J1.9 v6.35,19.05
  Bottom 0.203: v17.91,19.81 14.41,23.31 D1.4 14.41,24.32 14.1,24.64 11.68,24.64 11.43,24.38 11.43,21.59 8.89,19.05 v6.35,19.05
RX3_PRE
  Top 0.127: U1.29 40.32,19.11 40.26,19.05 37.72,19.05 36.96,19.81 R4.1
RX4  (via drill 0.25)
  Top 0.203: R8.2 18.8,17.27 v17.53,16 | J1.17 v6.35,13.97
  Bottom 0.203: 14.44,13.97 D5.4 14.35,14 14.35,14.73 | v6.35,13.97 7.24,13.97 8.26,14.99 14.1,14.99 14.35,14.73 | 14.35,14.73 15.62,16 v17.53,16
RX4_PRE
  Top 0.127: U1.34 41.62,17.11 41.53,17.02 37.08,17.02 36.83,17.27 R8.1
RX5  (via drill 0.25)
  Top 0.203: R9.1 19.18,14.73 17.02,12.57 v16.26,12.57 15.49,11.81 14.51,11.81 D8.4 14.35,11.65 14.35,10.79 14.22,10.67 11.94,10.67 11.43,11.18 11.43,12.7 10.16,13.97 J1.18 | J4.4 v20.19,10.79
  Bottom 0.203: v20.19,10.79 18.41,12.57 v16.26,12.57
RX5_PRE
  Top 0.127: U1.38 41.67,15.51 41.66,15.49 37.59,15.49 36.83,14.73 R9.2
RX6  (via drill 0.25)
  Top 0.203: R6.2 v15.75,18.54 | J1.13 v6.35,16.51
  Bottom 0.203: v15.75,18.54 15.24,18.54 14.99,18.8 14.44,18.8 D2.4 14.35,18.83 14.35,19.56 14.1,19.81 11.94,19.81 8.64,16.51 v6.35,16.51
RX6_PRE
  Top 0.127: U1.31 40.53,18.31 40.51,18.29 37.21,18.29 36.96,18.54 R6.1
SWCLK  (via drill 0.25)
  Top 0.127: J2.B6 v55.12,22.23 | v42.8,23.88 40.89,23.88 40.64,23.62 | R27.2 40.65,23.61 40.64,23.62 | J5.1 40.12,24.15 40.64,23.62
  Route15 0.127: v55.12,22.23 53.47,23.88 v42.8,23.88
SWCLK_PRE
  Top 0.127: U1.24 44.72,20.56 42.42,22.86 R27.1
SWDIO  (via drill 0.25)
  Top 0.127: J2.B5 v55.12,23.5 | J5.3 38.35,24.96 38.35,24.38 38.61,24.13 38.86,24.13 v39.12,23.88 39.12,22.73 40.01,21.84 R28.2
  Route15 0.127: v55.12,23.5 54.36,24.26 43.81,24.26 43.69,24.38 39.62,24.38 v39.12,23.88
SWDIO_PRE
  Top 0.127: U1.25 44.32,20.58 43.05,21.84 R28.1
TX0  (via drill 0.25)
  Top 0.127: U1.37 41.69,15.91 41.66,15.88 37.34,15.88 36.83,15.37 34.54,15.37
  Top 0.203: 34.54,15.37 18.92,15.37 17.53,13.97 v17.02,13.97 14.44,13.97 D7.3 14.35,14 14.35,14.73 14.1,14.99 11.3,14.99 11.05,15.24 J1.16 | J4.6 v21.46,10.79
  Bottom 0.203: v21.46,10.79 18.29,13.97 v17.02,13.97
TX1  (via drill 0.25)
  Top 0.127: U1.28 37.46,19.95 36.96,20.45 34.54,20.45
  Top 0.203: 34.54,20.45 17.65,20.45 v16.76,19.56 | v15.88,20.45 14.99,21.34 14.44,21.34 D4.4 14.35,21.3 14.35,20.57 14.1,20.32 11.56,20.32 10.29,19.05 J1.10
  Bottom 0.203: v16.76,19.56 v15.88,20.45
TX2  (via drill 0.25)
  Top 0.127: v38.99,21.21 37.59,21.21 37.08,21.72 34.54,21.72 | U1.18 47.12,20.45 47.37,20.7 v47.37,21.21
  Top 0.203: 34.54,21.72 17.27,21.72 15.4,23.59 D3.3 14.41,24.32 14.1,24.64 11.68,24.64 11.43,24.38 11.43,21.59 10.16,20.32 J1.8
  Route15 0.127: v47.37,21.21 47.12,21.46 39.24,21.46 v38.99,21.21
  Bottom 0.203: J3.6 35.69,22.48 37.08,21.08 38.35,21.08 38.48,21.21 v38.99,21.21
TX3  (via drill 0.25)
  Top 0.127: U1.30 40.43,18.71 40.39,18.67 37.47,18.67 36.96,19.18 34.54,19.18
  Top 0.203: 34.54,19.18 v18.8,19.18 | J1.7 v6.35,20.32
  Bottom 0.203: v18.8,19.18 18.8,21.46 14.41,25.85 D1.3 14.41,25.84 14.35,25.78 14.35,25.4 14.1,25.15 11.56,25.15 10.92,24.51 10.92,22.35 8.89,20.32 v6.35,20.32
TX4  (via drill 0.25)
  Top 0.127: U1.35 41.73,16.71 41.66,16.64 34.54,16.64
  Top 0.203: 34.54,16.64 v19.18,16.64 | J1.15 v6.35,15.24
  Bottom 0.203: v19.18,16.64 14.51,16.64 D5.3 14.35,16.48 14.35,15.75 14.1,15.49 7.87,15.49 7.62,15.24 v6.35,15.24
TX5
  Top 0.127: U1.39 41.66,15.11 37.85,15.11 36.83,14.1 34.54,14.1
  Top 0.203: 34.54,14.1 19.43,14.1 15.37,10.03 | 15.37,10.03 14.99,10.03 14.41,9.46 D8.3 14.41,9.46 13.72,10.16 11.68,10.16 10.92,10.92 10.92,11.94 10.16,12.7 J1.20 | J4.2 16.19,9.21 15.37,10.03
TX6  (via drill 0.25)
  Top 0.127: U1.32 41.78,17.91 41.66,18.03 40.89,18.03 40.77,17.91 34.54,17.91
  Top 0.203: 34.54,17.91 v16.76,17.91 | J1.11 v6.35,17.78
  Bottom 0.203: v16.76,17.91 16.76,18.67 14.86,20.57 | 14.86,20.57 14.41,21.02 D2.3 | v6.35,17.78 9.02,17.78 11.56,20.32 14.61,20.32 14.86,20.57
V1P1  (via drill 0.25)
  Top 0.127: v43.81,12.06 43.81,12.19 43.92,12.3 U1.45 | TP4.P$1 44.32,21.59 v44.96,20.95 45.12,20.79 U1.23 | U1.50 45.92,12.01 v45.85,11.94
  Route15 0.406: v43.81,12.06 43.81,13.08 | 43.81,13.08 43.81,19.81 v44.96,20.95 | v45.85,11.94 45.85,12.45 45.21,13.08 43.81,13.08
  Bottom 0.203: C13.1 43.81,13.09 v43.81,12.06 | C17.1 45.85,13.09 v45.85,11.94 | C16.1 44.96,19.8 v44.96,20.95
V3P3  (via drill 0.25)
  Top 0.127: R23.1 v41.66,9.14 | U3.8 47.49,9.16 v47.5,9.14 | R17.2 v53.59,10.41 | U1.33 41.29,17.51 v41.27,17.53 | U1.44 43.52,12.53 43.18,12.19 v43.18,11.81 | U1.42 41.34,13.91 v41.27,13.84 | U1.22 45.52,20.88 v45.59,20.95 | U1.10 49.77,17.51 49.78,17.53 50.16,17.53 v50.29,17.65 | U1.1 50.1,13.91 v50.16,13.84 | U1.48 45.12,12.16 v45.21,12.06 45.52,12.37 U1.49 | R18.2 v54.6,18.55 v54.61,18.54 | U5.8 29.48,25.29 29.34,25.15 v28.83,25.15 28.07,25.15 C24.1 | U5.5 28.58,27.42 v28.57,27.43 | U5.12 v32,26.42 | R25.2 34.29,29.21 34.04,29.46 33.02,29.46 | 33.02,29.46 v32.26,29.46 | R26.2 33.02,29.46
  Top 0.203: J2.B16 v55.12,9.53 | D3.6 12.45,26.19 v12.45,27.3 | D4.6 12.45,21.37 v12.45,22.48 | D7.6 12.45,16.54 v12.45,17.65 | D8.6 12.45,11.71 v12.45,12.83 | TP2.P$1 v30.73,10.16
  Bottom 0.203: C6.1 48.39,9.14 v47.5,9.14 | C21.1 v41.27,17.53 | C14.1 43.18,11.29 v43.18,11.81 | C19.1 49.01,17.65 v50.29,17.65 50.29,16.76 49.91,16.38 C5.1 | C20.1 45.59,19.93 v45.59,20.95 | C23.1 v41.27,13.84 | C18.1 44.96,12.32 v45.21,12.06 | v50.16,13.84 49.52,13.84 C22.1 | D1.6 12.45,23.59 v12.45,22.48 | D2.6 12.45,18.77 v12.45,17.65 | D5.6 12.45,13.94 v12.45,12.83 | D6.6 12.45,9.11 v12.45,8
  Bottom 0.254: U2.1 48.51,28.33 | 48.51,28.33 C4.1 | 48.51,28.33 v48.51,27.69 v48.51,27.05
  pour Route15 (isolate 0.203, rank 2, no thermals): 11.18,31.11 57.15,31.11 57.15,5.08 11.18,5.08
V9P0  (via drill 0.25)
  Top 0.406: J2.A18 v58.04,6.99 | v34.42,4.19 R11.1
  Route15 0.406: v58.04,6.99 56.77,6.99 55.63,8.13 41.91,8.13 38.1,4.32 35.81,4.32 35.69,4.19 v34.42,4.19
VBUS  (via drill 0.25)
  Top 0.254: J6.1 43.66,7.65 43.31,8 v43.31,9.02
  Bottom 0.254: D9.2 52.69,24.53 52.96,24.26 53.72,24.26 53.99,24.53 D9.1
  Bottom 0.406: D9.1 54.1,24.82 54.1,25.27 54.36,25.53 55.5,25.53 55.88,25.15 55.88,8.89 55.12,8.13 48.26,8.13 48.01,8.38 43.94,8.38 v43.31,9.02
VIMU  (via drill 0.25)
  Top 0.203: R12.2 18.92,27.94 v18.92,28.45 | TP3.P$1 11.94,28.45
  Top 0.305: U4.6 19.97,28.45 v18.92,28.45 18.17,28.45 C10.1 | J1.3 6.1,22.86 6.35,23.11 | J1.1 6.35,24.13
  Top 0.406: C10.1 17.9,28.45 11.94,28.45 8.89,28.45 6.35,25.91 6.35,24.13 6.35,23.11
  Bottom 0.203: C9.1 19.68,28.45 v18.92,28.45
VIMU_EN  (via drill 0.25)
  Top 0.127: U1.13 50.08,18.71 51.05,19.68 51.05,22.1 v50.29,22.86
  Top 0.203: U4.3 21.78,30.41 21.59,30.23 21.59,28.07 22.23,27.43 R19.2 22.74,26.92 22.99,26.67 22.99,24.13 23.88,23.24 v37.59,23.24
  Route15 0.127: v50.29,22.86 50.04,23.11 46.61,23.11 46.48,22.99 37.85,22.99 v37.59,23.24
VIMU_SENSE  (via drill 0.25)
  Top 0.127: U1.41 40.98,14.31 40.39,13.72 40.39,13.45 C1.1 39.87,13.46 39.5,13.46 R15.2 v39.24,14.22
  Top 0.203: v19.43,24.89 19.43,25.41 R12.1
  Bottom 0.203: v39.24,14.22 30.1,23.37 20.95,23.37 v19.43,24.89
VIN  (via drill 0.25)
  Top 0.203: 53.09,26.67 53.27,26.67 D9.3
  Top 0.305: 53.09,26.67 C2.1 52.97,26.67 v51.94,26.67 v51.31,26.67 | C7.1 23.89,28.31 v23.75,28.45 22.7,28.45 U4.1
  Top 0.406: v51.31,26.67 48.01,29.97 TP1.P$1 43.69,30.99 28.57,30.99 25.91,28.32 24.65,28.32 C7.1
  Bottom 0.127: U2.5 53.1,29.83 53.21,29.72 53.21,28.7 53.34,28.57
  Bottom 0.203: D10.3 50.35,26.6 50.42,26.67 | v23.75,28.45 v23.74,28.46 C8.1
  Bottom 0.254: U2.8 53.1,28.33 53.34,28.57 C3.1
  Bottom 0.305: C3.1 53.85,27.11 D9.3 53.34,26.67 v51.94,26.67 | v51.94,26.67 v51.31,26.67 | v51.94,26.67 50.36,26.67 D10.3
VIN_BP  (via drill 0.25)
  Top 0.254: J2.A3 58.04,26.04 58.67,26.67 58.67,27.94 | J2.B1 54.86,28.57 54.48,28.19 54.48,26.54 54.99,26.04 J2.B3 | J2.A1 58.17,28.57
  Top 0.305: 58.67,27.94 58.17,28.45 58.17,28.57 58.17,29.21 57.91,29.46 55.12,29.46 54.86,29.21 54.86,28.57
  Top 0.406: v49.28,26.16 v49.28,25.53 50.67,24.13 52.07,24.13 52.45,23.75 53.85,23.75 54.1,24 54.1,25.15 54.99,26.04
  Bottom 0.203: D10.1 50.94,24.53 50.55,24.13 50.16,24.13 49.64,24.65 D10.2
  Bottom 0.305: D10.2 49.64,24.78 49.28,25.15 v49.28,26.16
VN3P0  (via drill 0.25)
  Top 0.406: v58.04,5.71 J2.A19 | v34.42,2.54 R13.1
  Bottom 0.406: v58.04,5.71 57.4,5.08 53.85,5.08 53.34,5.59 40.51,5.59 37.47,2.54 v34.42,2.54
VN22  (via drill 0.25)
  Top 0.406: J2.B20 v55.12,4.45 | v36.58,3.43 34.16,5.84 R14.1
  Route15 0.406: v55.12,4.45 54.48,4.45 53.34,5.59 40.51,5.59 38.35,3.43 v36.58,3.43

### Text on the board
Bottom: BZ
tPlace: I
bPlace: I | NinjaNIRS 2024 / IMU Interface / v01 01/2025 | BZIM@BU.EDU
tNames: SWD | VIMU | Vin | 1.1V | TX3 | RX3 | TX4 | RX4 | 3.3V | GND | GND | BOOTSEL
bNames: GND | SCL | SDA | TX2 | RX2 | GND